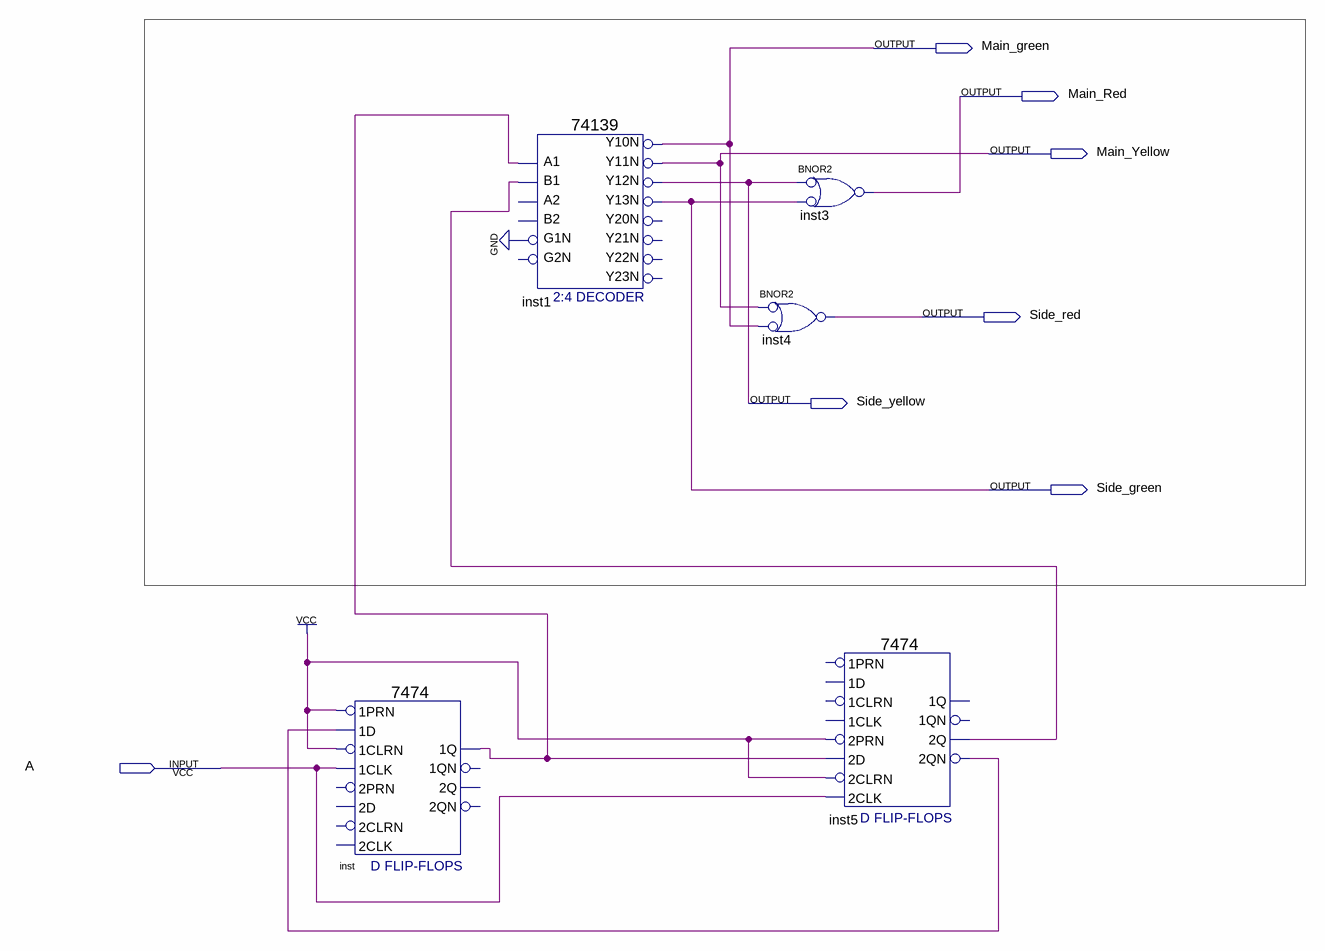
[diagram p0: schematic sheet]
// Quartus schematic Lab13.bdf as structural Verilog: 5 symbols, 7 pins
module Lab13 (
  input  A,
  output Main_green,
  output Main_Red,
  output Main_Yellow,
  output Side_red,
  output Side_yellow,
  output Side_green
);

  wire inst5_2q, inst5_2qn, inst_1q;

  \7474  inst (
    .\1CLK (A), .\1D (inst5_2qn), .\1PRN (1'b1), .\1CLRN (1'b1), .\1Q (inst_1q));  // open: 2D, 2PRN, 2CLK, 2CLRN, 1QN, 2Q, 2QN
  \74139  inst1 (
    .A1(inst_1q), .B1(inst5_2q), .G1N(1'b0), .Y10N(Main_green), .Y13N(Side_green), .Y12N(Side_yellow),
    .Y11N(Main_Yellow));  // open: A2, B2, G2N, Y20N, Y21N, Y22N, Y23N
  nor inst4 (Side_red, ~Main_Yellow, ~Main_green);  // BNOR2
  nor inst3 (Main_Red, ~Side_yellow, ~Side_green);  // BNOR2
  \7474  inst5 (
    .\2D (inst_1q), .\2PRN (1'b1), .\2CLK (A), .\2CLRN (1'b1), .\2Q (inst5_2q), .\2QN (inst5_2qn));  // open: 1CLK, 1D, 1PRN, 1CLRN, 1QN, 1Q
endmodule
